# EAGLE design RGB_module (EAGLE 8.6.3)
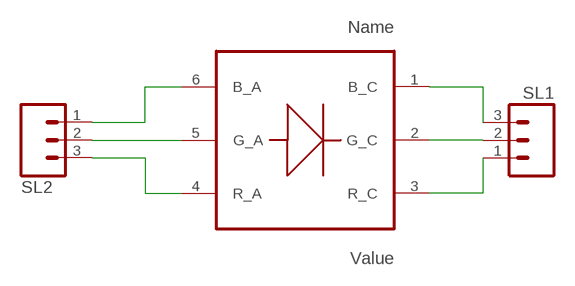
[diagram p0: schematic, sheet 1]

## Parts
RGB_MODULE  RGB_SMD_3W  [RGB_SMD_6PIN]
SL1  M03  [03P]
SL2  M03  [03P]

## Nets
B: RGB_MODULE.1(B_C) SL1.3
C: RGB_MODULE.3(R_C) SL1.1
G: RGB_MODULE.2(G_C) SL1.2
N$1: RGB_MODULE.4(R_A) SL2.3
N$2: RGB_MODULE.6(B_A) SL2.1
N$3: RGB_MODULE.5(G_A) SL2.2

## Library data of the parts
RGB_MODULE = CEDT_JANUARY_2015_v5:RGB_SMD_3W: RGB SMD 3W(1W each)
SL1 SL2 = con-amp-quick:M03: AMP QUICK CONNECTOR; OC_FARNELL: unknown; OC_NEWARK: unknown

## Board
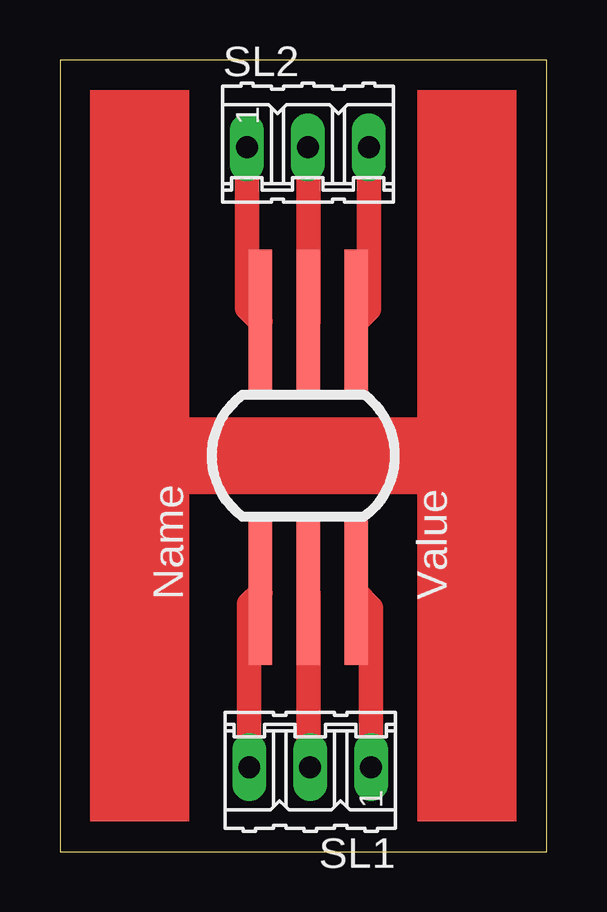
[diagram p1: board, top side]

Size 20.31 x 33.01 mm. Coordinates in mm from the lower left corner, seen from the top.
Outline: 20.31,0 20.31,33.01 0,33.01 0,0 20.31,0
Copper layers (1*16): Top 0.035mm / dielectric 1.5mm / Bottom 0.035mm
Design rules "default": minimum track width 6mil, minimum drill 0.35mm, track to track 6mil, track to pad 6mil, pad to pad 6mil, via to via 6mil, smd to smd 6mil, copper to edge 40mil, drill to drill 6mil, minimum pad ring 10mil, minimum via ring 8mil, stop-mask expansion 4mil, vias tented up to drill 0mil, thermal gap 10mil

### Footprints (pad centres in the part's own frame; a part is rotated, then mirrored left to right if it is on the bottom)
RGB_SMD_6PIN = smd 6 x 0.998: 1 -5.728,1.795; 2 -5.728,-0.205; 3 -5.728,-2.205; 4 5.59,-2.205; 5 5.59,-0.205; 6 5.59,1.795
03P = drill 0.914 long: 1 -2.54,0; 2 0,0; 3 2.54,0

### Placement (x,y rotation side)
RGB_MODULE  10.15,16.51 90 top
SL1  10.44,3.52 180 top
SL2  10.34,29.37 0 top

### Tracks (layer width: path | path; a pad name or v marks a point on that pad's centre or on a via)
B
  Top 1.016: SL1.3 7.9,10.32 RGB_MODULE.1
C
  Top 1.016: SL1.1 12.98,10.16 RGB_MODULE.3
G
  Top 1.016: RGB_MODULE.2 10.36,3.6 SL1.2
N$1
  Top 1.016: SL2.3 12.88,22.62 RGB_MODULE.4
N$2
  Top 1.016: SL2.1 7.8,22.65 RGB_MODULE.6
N$3
  Top 1.016: RGB_MODULE.5 10.36,29.35 SL2.2
(copper drawn outside any net)
  shapes: Top area x3